# Altium schematic sheet bias_LNA.SchDoc
size A
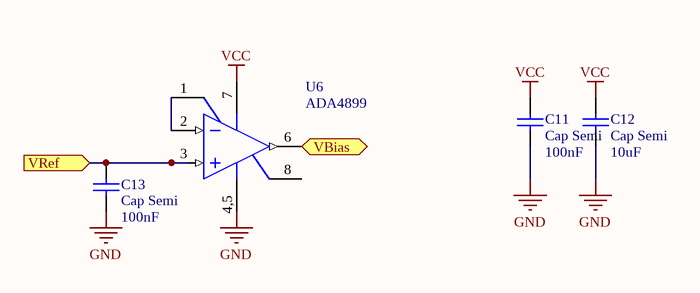
[diagram p0: bias_LNA.SchDoc]

## Parts
C11  Cap Semi  value 100nF  [C0805]
C12  Cap Semi  value 10uF  [C0805]
C13  Cap Semi  value 100nF  [C0805]
U6  ADA4899  [SO8_N]

## Ports
VBias (out), VRef (in)

## Nets
GND: C11.1 C12.1 C13.1 U6.4,5(V-)
VCC: C11.2 C12.2 U6.7(V+)
VBias: U6.6(OUT) ; port VBias
VRef: C13.2 U6.3(IN+) ; port VRef
NetU6_1: U6.1(FB) U6.2(IN-)

Not connected (* = marked no-connect by the designer): U6 8(CMPEN)

## Library data of the parts
C11-C13 = Cap Semi: Capacitor (Semiconductor SIM Model); Published: 8-Jun-2000; LatestRevisionDate: 29-May-2009; LatestRevisionNote: IPC-7351 Footprint Added.; PackageReference: C1206; Publisher: Altium Limited; PackageDescription: Chip Capacitor
U6 = ADA4899: High Speed, Low Voltage Noise, Unity Gain Stable Op-Amp; Datasheet: http://www.analog.com/static/imported-files/data_sheets/ADA4899-1.pdf; Digikey Product Sheet: http://www.digikey.ca/product-search/en/integrated-circuits-ics/linear-amplifiers-instrumentation-op-amps-buffer-amps/2556125?k=ADA4899